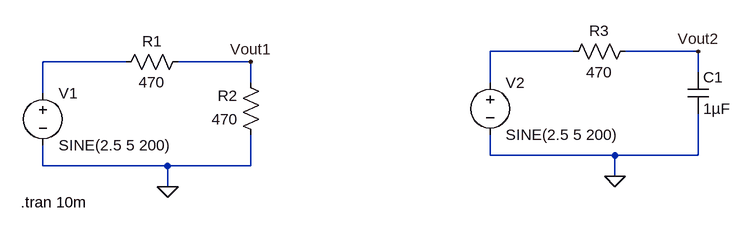
[diagram p0: schematic phase_ltspice.asc]
phase_ltspice.asc, the LTspice schematic file:
Version 4
SHEET 1 1028 680
WIRE 784 112 656 112
WIRE 976 112 864 112
WIRE 96 128 -32 128
WIRE 288 128 176 128
WIRE 976 144 976 112
WIRE 288 160 288 128
WIRE 656 160 656 112
WIRE -32 176 -32 128
WIRE 656 272 656 240
WIRE 848 272 656 272
WIRE 976 272 976 208
WIRE 976 272 848 272
WIRE -32 288 -32 256
WIRE 160 288 -32 288
WIRE 288 288 288 240
WIRE 288 288 160 288
WIRE 848 304 848 272
WIRE 160 320 160 288
FLAG 288 128 Vout1
FLAG 160 320 0
FLAG 976 112 Vout2
FLAG 848 304 0
SYMBOL res 192 112 R90
WINDOW 0 0 56 VBottom 2
WINDOW 3 32 56 VTop 2
SYMATTR InstName R1
SYMATTR Value 470
SYMBOL res 304 256 R180
WINDOW 0 36 76 Left 2
WINDOW 3 36 40 Left 2
SYMATTR InstName R2
SYMATTR Value 470
SYMBOL voltage -32 160 R0
WINDOW 123 0 0 Left 0
WINDOW 39 0 0 Left 0
SYMATTR InstName V1
SYMATTR Value SINE(2.5 5 200)
SYMBOL res 880 96 R90
WINDOW 0 0 56 VBottom 2
WINDOW 3 32 56 VTop 2
SYMATTR InstName R3
SYMATTR Value 470
SYMBOL voltage 656 144 R0
WINDOW 123 0 0 Left 0
WINDOW 39 0 0 Left 0
SYMATTR InstName V2
SYMATTR Value SINE(2.5 5 200)
SYMBOL cap 960 144 R0
SYMATTR InstName C1
SYMATTR Value 1µF
TEXT -66 344 Left 2 !.tran 10m

The netlist it stands for:
* phase_ltspice.asc
R1 Vout1 N002 470
R2 0 Vout1 470
V1 N002 0 SINE(2.5 5 200)
R3 Vout2 N001 470
V2 N001 0 SINE(2.5 5 200)
C1 Vout2 0 1µF
.tran 10m
.backanno
.end